# EAGLE design Projekt (EAGLE 9.6.2)

## Sheet 1 of 2
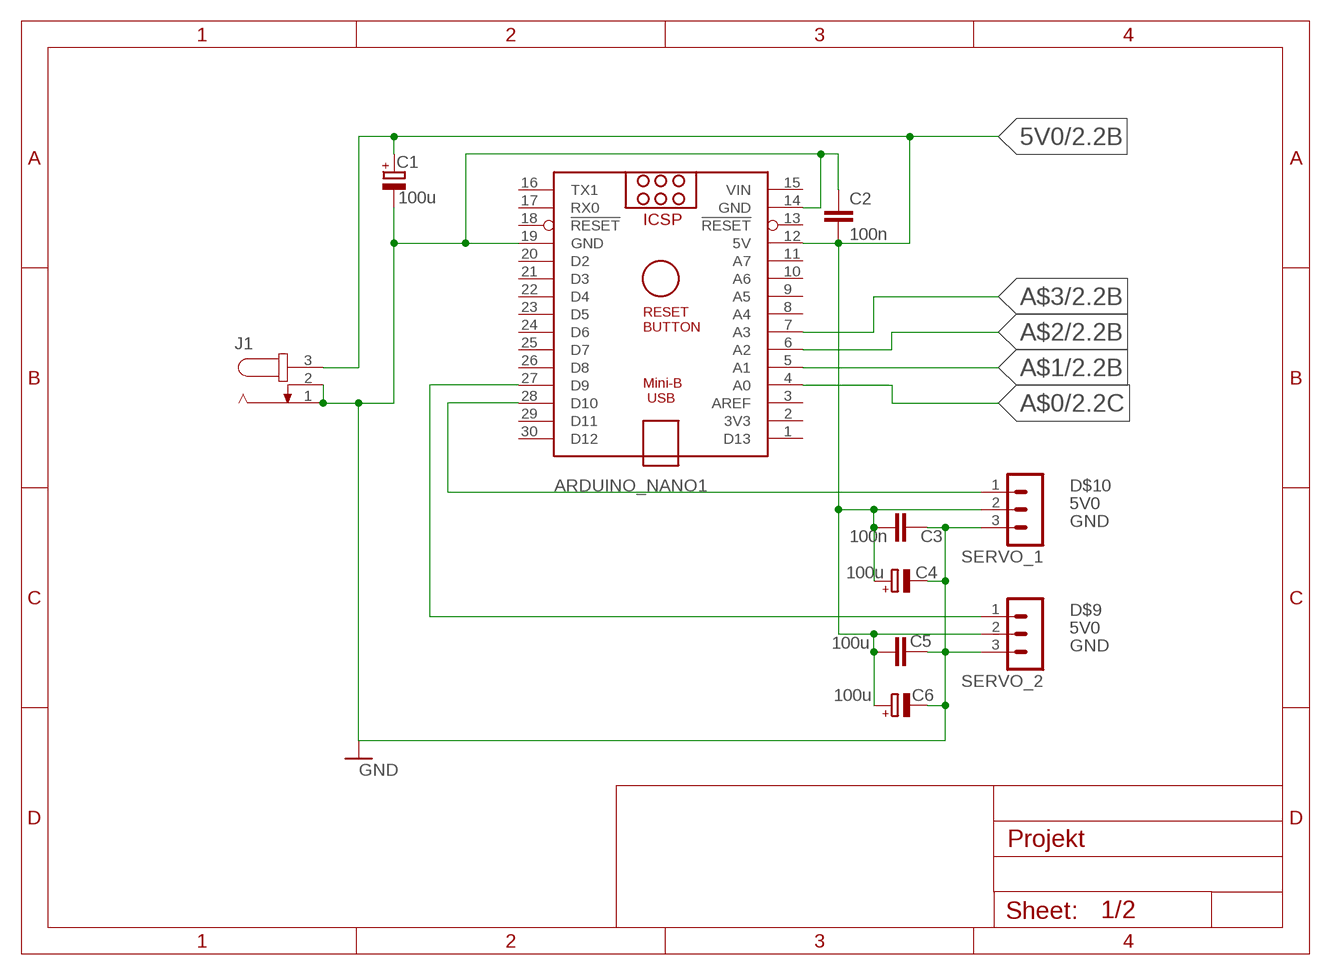
[diagram p0: schematic, sheet 1]
FRAME3 (DINA5_L): DESCRIPTION: Solar tracker

### Parts
ARDUINO_NANO1  ARDUINO_NANO  [ARDUINO_NANO]
C1  100u  CPOL-EUE2,5-6E  [E2,5-6E]
C2  100n  C-EU050-024X044  [C050-024X044]
C3  100n  C-EU050-024X044  [C050-024X044]
C4  100u  CPOL-EUE2,5-6E  [E2,5-6E]
C5  100u  C-EU050-024X044  [C050-024X044]
C6  100u  CPOL-EUE2,5-6E  [E2,5-6E]
J1  JACK-PLUG0  [SPC4077]
SERVO_1  MA03-1  [MA03-1]
SERVO_2  MA03-1  [MA03-1]

### Nets
5V0 [VCC/GND]: ARDUINO_NANO1.12(5V) C1.+ C2.2 C3.2 C4.+ C5.2 C6.+ J1.3 SERVO_1.2 SERVO_2.2 ; also sheet 2
A$0: ARDUINO_NANO1.4(A0) ; also sheet 2
A$1: ARDUINO_NANO1.5(A1) ; also sheet 2
A$2: ARDUINO_NANO1.6(A2) ; also sheet 2
A$3: ARDUINO_NANO1.7(A3) ; also sheet 2
D$9: ARDUINO_NANO1.27(D9) SERVO_2.1
D$10: ARDUINO_NANO1.28(D10) SERVO_1.1
GND [VCC/GND]: ARDUINO_NANO1.14(GND) ARDUINO_NANO1.19(GND) C1.- C2.1 C3.1 C4.- C5.1 C6.- J1.1 J1.2 SERVO_1.3 SERVO_2.3 ; also sheet 2
Unconnected: ARDUINO_NANO1.1(D13) ARDUINO_NANO1.2(3V3) ARDUINO_NANO1.3(AREF) ARDUINO_NANO1.8(A4) ARDUINO_NANO1.9(A5) ARDUINO_NANO1.10(A6) ARDUINO_NANO1.11(A7) ARDUINO_NANO1.13(!RESET) ARDUINO_NANO1.16(TX1) ARDUINO_NANO1.17(RX0) ARDUINO_NANO1.18(!RESET) ARDUINO_NANO1.20(D2) ARDUINO_NANO1.21(D3) ARDUINO_NANO1.22(D4) ARDUINO_NANO1.23(D5) ARDUINO_NANO1.24(D6) ARDUINO_NANO1.25(D7) ARDUINO_NANO1.26(D8) ARDUINO_NANO1.29(D11) ARDUINO_NANO1.30(D12)

## Sheet 2 of 2
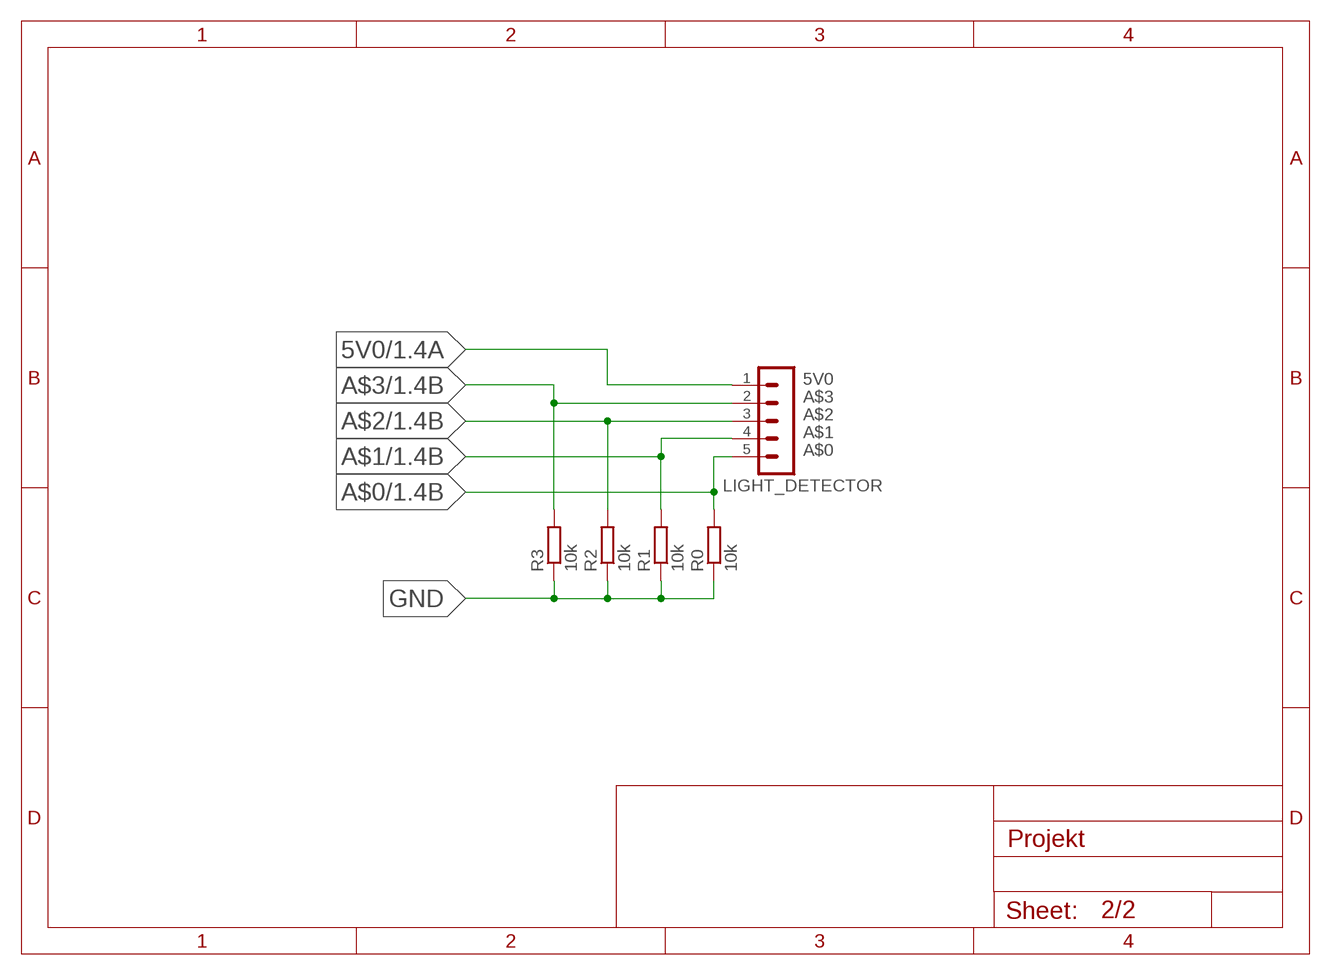
[diagram p1: schematic, sheet 2]

### Parts
LIGHT_DETECTOR  MA05-1  [MA05-1]
R0  10k  R-EU_0207/10  [0207/10]
R1  10k  R-EU_0207/10  [0207/10]
R2  10k  R-EU_0207/10  [0207/10]
R3  10k  R-EU_0207/10  [0207/10]

### Nets
5V0 [VCC/GND]: LIGHT_DETECTOR.1 ; also sheet 1
A$0: LIGHT_DETECTOR.5 R0.2 ; also sheet 1
A$1: LIGHT_DETECTOR.4 R1.2 ; also sheet 1
A$2: LIGHT_DETECTOR.3 R2.2 ; also sheet 1
A$3: LIGHT_DETECTOR.2 R3.2 ; also sheet 1
GND [VCC/GND]: R0.1 R1.1 R2.1 R3.1 ; also sheet 1

## Power pins joined to a net without a drawn wire
VIN: ARDUINO_NANO1.15(VIN)

## Library data of the parts
ARDUINO_NANO1 = ArduinoNanoV30:ARDUINO_NANO: Arduino Nano V3.0 Overview: The Arduino Nano is a small, complete, and breadboard-friendly board based on the ATmega328 (Arduino Nano 3.x) or ATmega168 (Arduino Nano 2.x). It has more or less the same functionality of the Arduino Duemilanove, but in a different package. It lacks only a DC power jack, and works with a Mini-B USB cable instead of a standard one. The Nano was designed and is being produced by Gravitech. Specifications: Microcontroller Atmel ATmega168 or ATmega328 Operating Voltage (logic level) 5 V Input Voltage (recommended) 7-12 V Input Voltage (limits) 6-20 V Digital I/O Pins 14 (of which 6 provide PWM output) Analog Input Pins 8 DC Current per I/O Pin 40 mA Flash Memory 16 KB (ATmega168) or 32 KB (ATmega328) of which 2 KB used by bootloader SRAM 1 KB (ATmega168) or 2 KB (ATmega328) EEPROM 512 bytes (ATmega168) or 1 KB (ATmega328) Clock Speed 16 MHz Dimensions 0.73" x 1.70" Length 45 mm Width 18 mm Weigth 5 g Power: The Arduino Nano can be powered via the Mini-B USB connection, 6-20V unregulated external power supply (pin 30), or 5V regulated external power supply (pin 27). The power source is automatically selected to the highest voltage source. Memory: The ATmega168 has 16 KB of flash memory for storing code (of which 2 KB is used for the bootloader); the ATmega328 has 32 KB, (also with 2 KB used for the bootloader). The ATmega168 has 1 KB of SRAM and 512 bytes of EEPROM (which can be read and written with the EEPROM library); the ATmega328 has 2 KB of SRAM and 1 KB of EEPROM. Input and Output: Each of the 14 digital pins on the Nano can be used as an input or output, using pinMode(), digitalWrite(), and digitalRead() functions. They operate at 5 volts. Each pin can provide or receive a maximum of 40 mA and has an internal pull-up resistor (disconnected by default) of 20-50 kOhms. In addition, some pins have specialized functions. Visit Arduino - ArduinoBoardNano <https://www.arduino.cc/en/Main/ArduinoBoardNano>
C1 C4 C6 = rcl:CPOL-EU: POLARIZED CAPACITOR, European symbol; SPICEPREFIX: C
C2 C3 C5 = rcl:C-EU: CAPACITOR, European symbol; SPICEPREFIX: C
J1 = con-jack:JACK-PLUG: DC POWER JACK Power Jack, DC, Right Angle, Through Hole, Rated 5A at 16VDC, PC Terminals Distributor: Farnell (www.Farnell.de) Drawing: 84N1161.pdf / 84N1162.pdf Manufacturer: SPC Technology (www.spctechnology.com) Type: SPC4077 / SPC 4078; OC_FARNELL: unknown; OC_NEWARK: unknown
LIGHT_DETECTOR = con-lstb:MA05-1: PIN HEADER; OC_FARNELL: unknown; OC_NEWARK: unknown
R0 R1-R3 = rcl:R-EU_: RESISTOR, European symbol; SPICEPREFIX: R
SERVO_1 SERVO_2 = con-lstb:MA03-1: PIN HEADER; OC_FARNELL: unknown; OC_NEWARK: unknown

## Net classes
0 default: width 0.406 mm
1 VCC/GND: width 0.61 mm

## Board
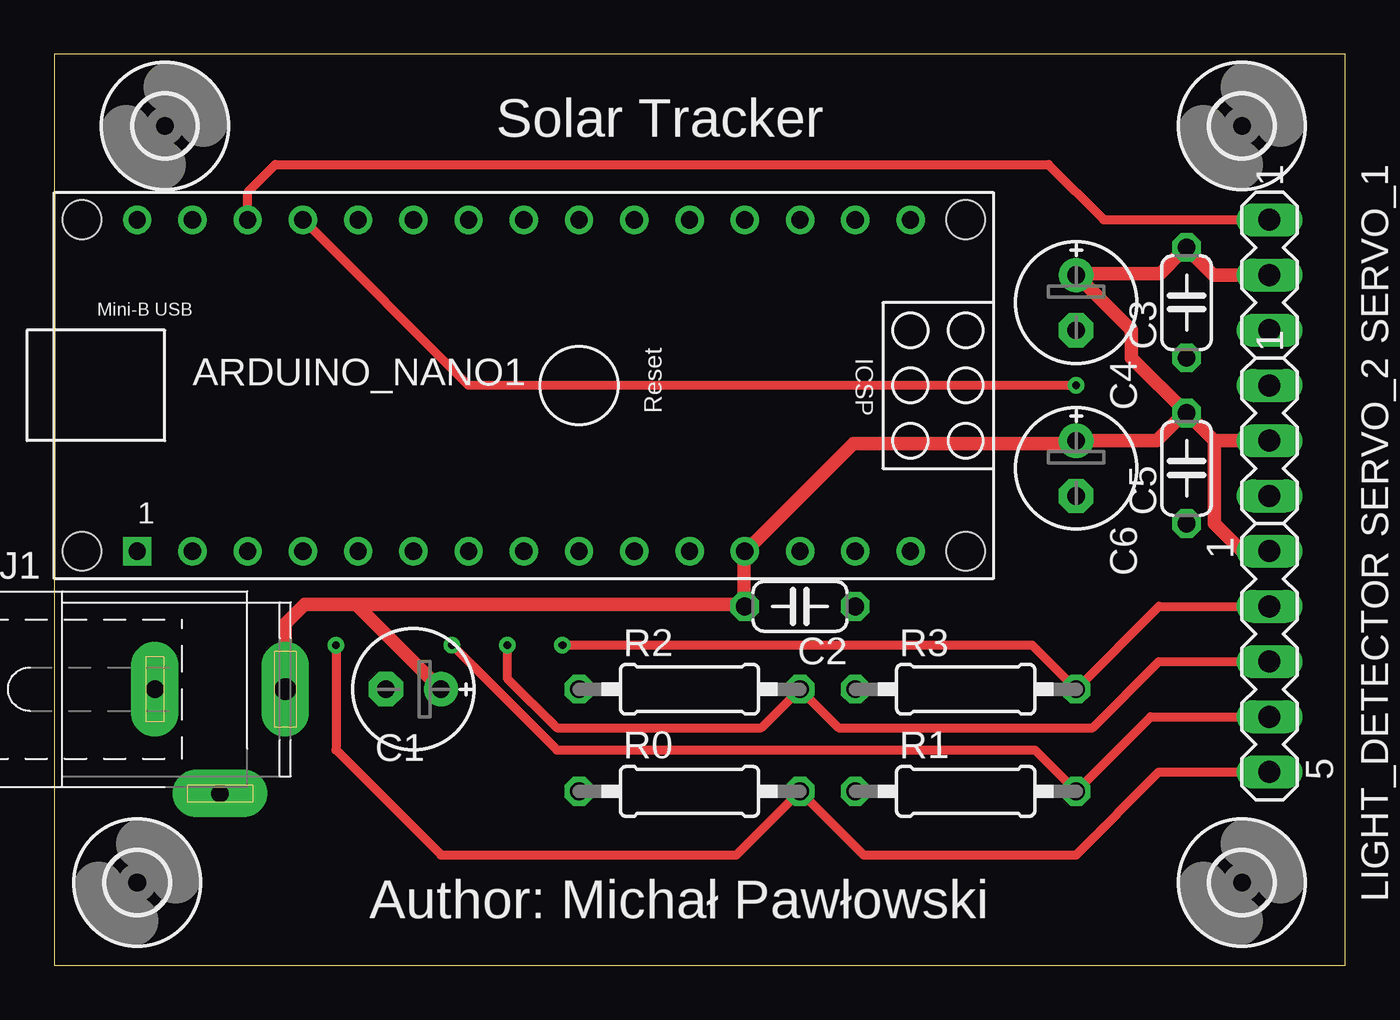
[diagram p2: board, top side]
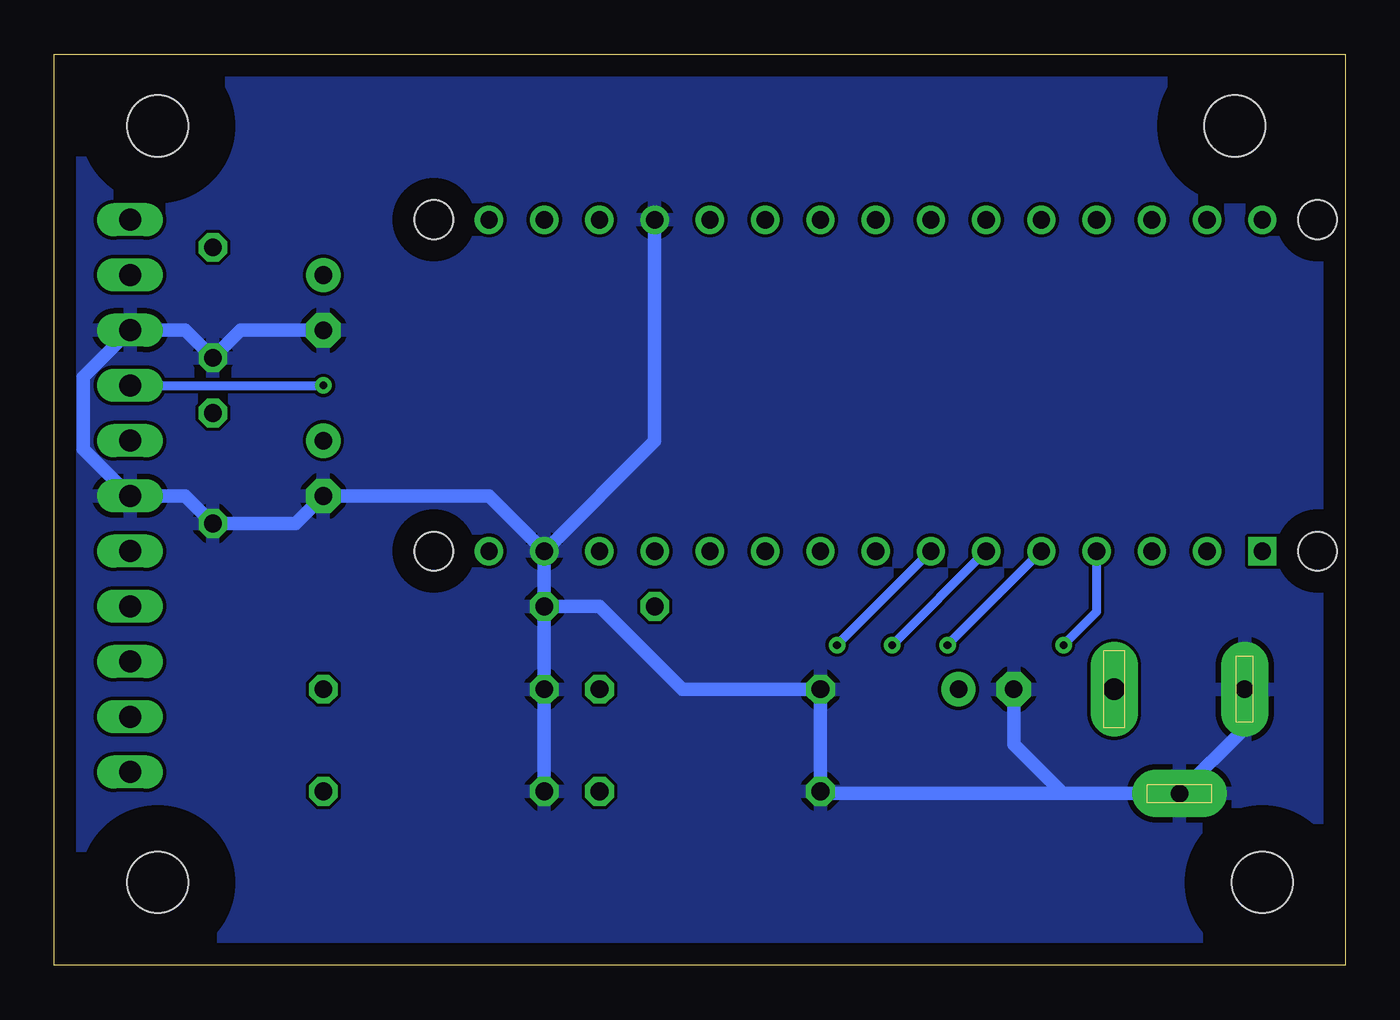
[diagram p3: board, bottom side, seen from below]

Size 59.36 x 41.9 mm. Coordinates in mm from the lower left corner, seen from the top.
Outline: 0,41.9 0,0 59.36,0 59.36,41.9 0,41.9
Copper layers (1*16): Top 0.035mm / dielectric 1.5mm / Bottom 0.035mm
Design rules "default": minimum track width 6mil, minimum drill 0.35mm, track to track 6mil, track to pad 6mil, pad to pad 6mil, via to via 6mil, smd to smd 6mil, copper to edge 40mil, drill to drill 6mil, minimum pad ring 10mil, minimum via ring 8mil, stop-mask expansion 4mil, vias tented up to drill 0mil, thermal gap 10mil

### Footprints (pad centres in the part's own frame; a part is rotated, then mirrored left to right if it is on the bottom)
ARDUINO_NANO = drill 0.8 square: 1 -20.32,-7.62 | drill 0.8: 2 -17.78,-7.62; 3 -15.24,-7.62; 4 -12.7,-7.62; 5 -10.16,-7.62; 6 -7.62,-7.62; 7 -5.08,-7.62; 8 -2.54,-7.62; 9 0,-7.62; 10 2.54,-7.62; 11 5.08,-7.62; 12 7.62,-7.62; 13 10.16,-7.62; 14 12.7,-7.62; 15 15.24,-7.62; 16 15.24,7.62; 17 12.7,7.62; 18 10.16,7.62; 19 7.62,7.62; 20 5.08,7.62; 21 2.54,7.62; 22 0,7.62; 23 -2.54,7.62; 24 -5.08,7.62; 25 -7.62,7.62; 26 -10.16,7.62; 27 -12.7,7.62; 28 -15.24,7.62; 29 -17.78,7.62; 30 -20.32,7.62 | hole 1.778: -22.86,-7.62; -22.86,7.62; 17.78,7.62; 17.78,-7.62
E2,5-6E = drill 0.813 pad 1.575: + -1.27,0 | drill 0.813 pad 1.575 octagon: - 1.27,0
C050-024X044 = drill 0.813 octagon: 1 -2.54,0; 2 2.54,0
SPC4077 = drill 0.8 pad 2.184 long: 1 -3,0; 2 0,-4.8 | drill 1 pad 2.184 long: 3 3,0
MA05-1 = drill 1.016 long: 1 -5.08,0; 2 -2.54,0; 3 0,0; 4 2.54,0; 5 5.08,0
0207/10 = drill 0.813 octagon: 1 -5.08,0; 2 5.08,0
MA03-1 = drill 1.016 long: 1 -2.54,0; 2 0,0; 3 2.54,0
2,8 = hole 2.8: 0,0

### Placement (x,y rotation side)
ARDUINO_NANO1  24.13,26.67 0 top
C1  16.51,12.7 180 top
C2  34.29,16.51 180 top
C3  52.07,30.48 90 top
C4  46.99,30.48 270 top
C5  52.07,22.86 90 top
C6  46.99,22.86 270 top
J1  7.62,12.7 0 top
LIGHT_DETECTOR  55.88,13.97 270 top
R0  29.21,8 0 top
R1  41.91,8 0 top
R2  29.21,12.7 0 top
R3  41.91,12.7 0 top
SERVO_1  55.88,31.75 270 top
SERVO_2  55.88,24.13 270 top
U$1  [2,8]  3.81,3.81 0 top
U$2  [2,8]  54.61,3.81 0 top
U$3  [2,8]  5.08,38.61 0 top
U$4  [2,8]  54.61,38.61 0 top

### Tracks (layer width: path | path; a pad name or v marks a point on that pad's centre or on a via)
5V0
  Top 0.61: 55.88,31.83 SERVO_1.2 53.3,31.75 52.11,32.94 C3.2 51.83,32.8 50.85,31.83 47.08,31.83 C4.+ 49.53,29.21 49.53,27.94 C5.2 | 31.71,16.6 31.71,18.97 | 31.71,18.97 ARDUINO_NANO1.12 | 31.71,16.6 C2.2 | 55.88,24.14 SERVO_2.2 53.34,24.13 | C5.2 51.83,25.26 50.71,24.14 47.08,24.14 C6.+ 46.8,24 38.1,24 37.58,24 36.74,24 31.71,18.97 | C5.2 53.34,24.13 | LIGHT_DETECTOR.1 54.61,19.05 53.34,20.32 53.34,24.13 | J1.3 10.62,15.7 11.52,16.6 13.97,16.6 | 13.97,16.6 31.71,16.6 | C1.+ 13.97,16.51 13.97,16.6
A$0  (via drill 0.35)
  Top 0.406: v12.95,14.73 12.95,9.91 17.78,5.08 31.37,5.08 R0.2 37.21,5.08 46.99,5.08 50.8,8.89 LIGHT_DETECTOR.5
  Bottom 0.406: v12.95,14.73 11.43,16.26 ARDUINO_NANO1.4
A$1  (via drill 0.35)
  Top 0.406: v18.29,14.73 23.11,9.91 45.09,9.91 R1.2 50.42,11.43 LIGHT_DETECTOR.4
  Bottom 0.406: ARDUINO_NANO1.5 v18.29,14.73
A$2  (via drill 0.35)
  Top 0.406: v20.83,14.73 20.83,13.21 23.11,10.92 32.51,10.92 R2.2 36.07,10.92 47.75,10.92 50.8,13.97 LIGHT_DETECTOR.3
  Bottom 0.406: ARDUINO_NANO1.6 v20.83,14.73
A$3  (via drill 0.35)
  Top 0.406: v23.37,14.73 44.96,14.73 R3.2 50.8,16.51 LIGHT_DETECTOR.2
  Bottom 0.406: ARDUINO_NANO1.7 v23.37,14.73
D$9  (via drill 0.35)
  Top 0.406: v46.99,26.67 19.05,26.67 ARDUINO_NANO1.27
  Bottom 0.406: SERVO_2.1 v46.99,26.67
D$10
  Top 0.406: ARDUINO_NANO1.28 8.89,35.56 10.16,36.83 45.72,36.83 48.26,34.29 SERVO_1.1
GND
  Bottom 0.61: 55.88,21.63 SERVO_2.3 | ARDUINO_NANO1.14 36.74,19.11 31.75,24.11 ARDUINO_NANO1.19 | SERVO_2.3 53.34,21.59 C5.1 48.26,20.32 C6.- 39.37,21.59 ARDUINO_NANO1.14 | C4.- 50.8,29.21 C3.1 52.11,27.91 52.11,27.98 53.34,29.21 SERVO_1.3 58.04,27.05 58.04,23.75 SERVO_2.3 | J1.1 4.62,10.9 J1.2 12.98,7.9 | 12.98,7.9 15.24,10.16 C1.- | ARDUINO_NANO1.14 C2.1 | 12.98,7.9 24.03,7.9 R0.1 R2.1 30.48,12.7 34.29,16.51 C2.1 | C2.1 R3.1 R1.1
  pour Bottom: 0,0 0,41.91 59.69,41.91 59.69,0 58.42,0

### Text on the board
tPlace: Solar Tracker | Author: Michał Pawłowski